# Altium schematic sheet SX1503.SchDoc
size 558 x 401 mm; Organization: Carnegie Institution of Washington; SheetNumber: 0; SheetTotal: 0
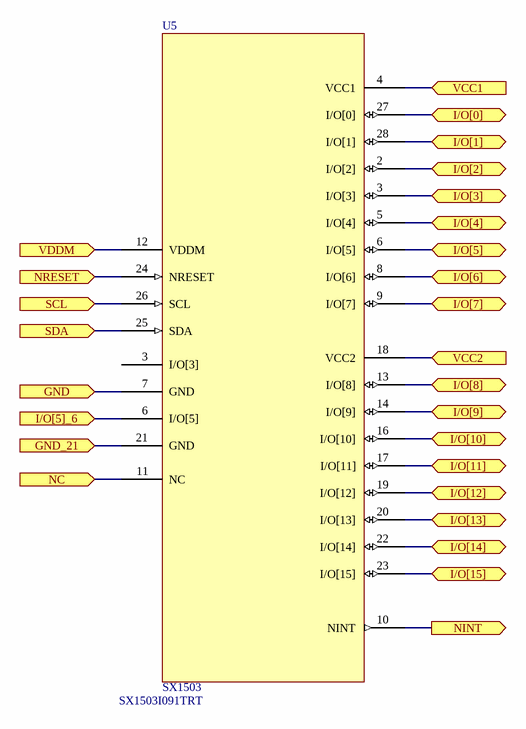
[diagram p0: SX1503.SchDoc]

## Parts
U5  SX1503  SEMTECH: SX1503I091TRT  [QFN-UT28]

## Ports
GND, GND_21, I/O[0] (bidir), I/O[1] (bidir), I/O[2] (bidir), I/O[3] (bidir), I/O[4] (bidir), I/O[5] (bidir), I/O[5]_6, I/O[6] (bidir), I/O[7] (bidir), I/O[8] (bidir), I/O[9] (bidir), I/O[10] (bidir), I/O[11] (bidir), I/O[12] (bidir), I/O[13] (bidir), I/O[14] (bidir), I/O[15] (bidir), NC, NINT (out), NRESET (in), SCL (in), SDA (in), VCC1, VCC2, VDDM

## Nets
GND: U5.7(GND) ; port GND
GND_21: U5.21(GND) ; port GND_21
I/O[0]: U5.27(I/O[0]) ; port I/O[0]
I/O[1]: U5.28(I/O[1]) ; port I/O[1]
I/O[2]: U5.2(I/O[2]) ; port I/O[2]
I/O[3]: U5.3(I/O[3]) ; port I/O[3]
I/O[4]: U5.5(I/O[4]) ; port I/O[4]
I/O[5]: U5.6(I/O[5]) ; port I/O[5]
I/O[5]_6: U5.6(I/O[5]) ; port I/O[5]_6
I/O[6]: U5.8(I/O[6]) ; port I/O[6]
I/O[7]: U5.9(I/O[7]) ; port I/O[7]
I/O[8]: U5.13(I/O[8]) ; port I/O[8]
I/O[9]: U5.14(I/O[9]) ; port I/O[9]
I/O[10]: U5.16(I/O[10]) ; port I/O[10]
I/O[11]: U5.17(I/O[11]) ; port I/O[11]
I/O[12]: U5.19(I/O[12]) ; port I/O[12]
I/O[13]: U5.20(I/O[13]) ; port I/O[13]
I/O[14]: U5.22(I/O[14]) ; port I/O[14]
I/O[15]: U5.23(I/O[15]) ; port I/O[15]
NC: U5.11(NC) ; port NC
NINT: U5.10(NINT) ; port NINT
NRESET: U5.24(NRESET) ; port NRESET
SCL: U5.26(SCL) ; port SCL
SDA: U5.25(SDA) ; port SDA
VCC1: U5.4(VCC1) ; port VCC1
VCC2: U5.18(VCC2) ; port VCC2
VDDM: U5.12(VDDM) ; port VDDM

## Notes on the sheet
- Carnegie Institution of Washington
- 813 Santa Barbara Street
- The Observatories
- PHONE (626) 577-1122               FAX (626) 795-8136
- Pasadena, California 91101
- Title:
- OCIW
- Size:
- Date:
- C
- Scale:
- Drawn By:
- Checked By:
- A. BAGISH
- alanb
- Revision:
- Sheet          of
- File:

## Library data of the parts
U5 = SX1503: i2C LV GPIO